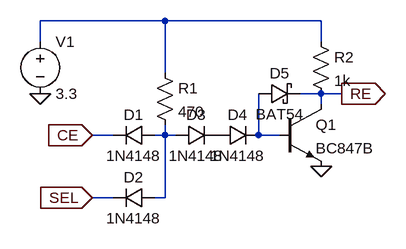
[diagram p0: schematic ROM.asc]
ROM.asc, the LTspice schematic file:
Version 4
SHEET 1 880 680
WIRE 112 -64 -80 -64
WIRE 352 -64 112 -64
WIRE -80 -32 -80 -64
WIRE 352 -32 352 -64
WIRE 112 16 112 -64
WIRE 352 48 320 48
WIRE 384 48 352 48
WIRE 352 64 352 48
WIRE 32 112 0 112
WIRE 112 112 112 96
WIRE 112 112 96 112
WIRE 128 112 112 112
WIRE 256 112 256 48
WIRE 288 112 256 112
WIRE 32 208 0 208
WIRE 112 208 112 112
WIRE 112 208 96 208
FLAG 0 112 CE
IOPIN 0 112 In
FLAG 0 208 SEL
IOPIN 0 208 In
FLAG -80 48 0
FLAG 352 160 0
FLAG 384 48 RE
IOPIN 384 48 Out
SYMBOL res 96 0 R0
SYMATTR InstName R1
SYMATTR Value 470
SYMBOL diode 96 96 R90
WINDOW 0 0 32 VBottom 2
WINDOW 3 32 32 VTop 2
SYMATTR InstName D1
SYMATTR Value 1N4148
SYMBOL diode 96 192 R90
WINDOW 0 0 32 VBottom 2
WINDOW 3 32 32 VTop 2
SYMATTR InstName D2
SYMATTR Value 1N4148
SYMBOL diode 128 128 R270
WINDOW 0 32 32 VTop 2
WINDOW 3 0 32 VBottom 2
SYMATTR InstName D3
SYMATTR Value 1N4148
SYMBOL diode 192 128 R270
WINDOW 0 32 32 VTop 2
WINDOW 3 0 32 VBottom 2
SYMATTR InstName D4
SYMATTR Value 1N4148
SYMBOL schottky 256 64 R270
WINDOW 0 32 32 VTop 2
WINDOW 3 0 32 VBottom 2
SYMATTR InstName D5
SYMATTR Value BAT54
SYMBOL npn 288 64 R0
SYMATTR InstName Q1
SYMATTR Value BC847B
SYMBOL voltage -80 -48 R0
SYMATTR InstName V1
SYMATTR Value 3.3
SYMBOL res 336 -48 R0
SYMATTR InstName R2
SYMATTR Value 1k

The netlist it stands for:
* ROM.asc
R1 N001 N002 470
D1 N002 CE 1N4148
D2 N002 SEL 1N4148
D3 N002 P001 1N4148
D4 P001 N003 1N4148
D5 N003 RE BAT54
Q1 RE N003 0 0 BC847B
V1 N001 0 3.3
R2 N001 RE 1k
.model D D
.lib standard.dio
.model NPN NPN
.model PNP PNP
.lib standard.bjt
.backanno
.end